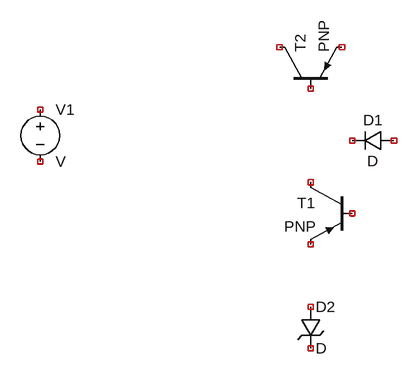
[diagram p0: schematic CurentRegul-1.asc]
CurentRegul-1.asc, the LTspice schematic file:
Version 4.1
SHEET 1 880 680
SYMBOL pnp 80 80 R270
SYMATTR InstName T2
SYMBOL pnp 192 224 M0
SYMATTR InstName T1
SYMBOL voltage -288 96 R0
SYMATTR InstName V1
SYMBOL diode 256 144 R90
WINDOW 0 0 32 VBottom 2
WINDOW 3 32 32 VTop 2
SYMATTR InstName D1
SYMBOL zener 112 416 R0
SYMATTR InstName D2

The netlist it stands for:
* CurentRegul-1.asc
Q§T2 NC_01 NC_02 NC_03 0 PNP
Q§T1 NC_04 NC_05 NC_06 0 PNP
V1 NC_07 NC_08 V
D1 NC_09 NC_10 D
D2 NC_11 NC_12 D
.model D D
.lib standard.dio
.model NPN NPN
.model PNP PNP
.lib standard.bjt
.backanno
.end